# EAGLE design TDA2822M (EAGLE 7.3.0)
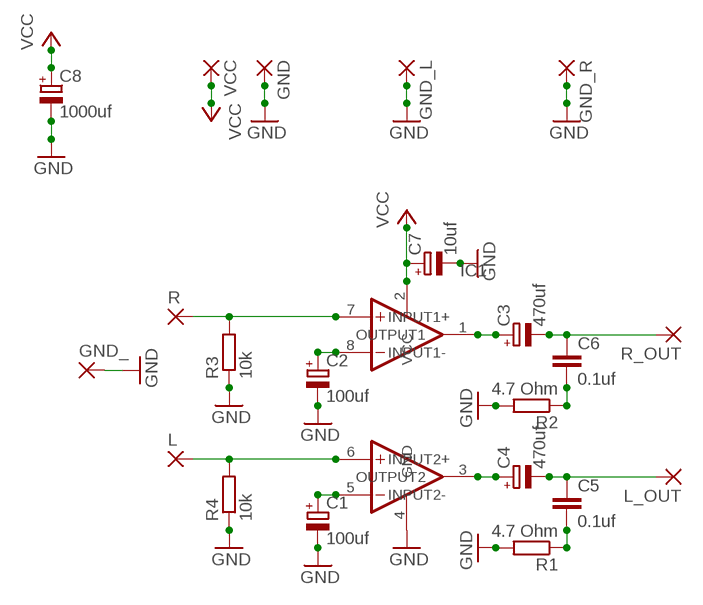
[diagram p0: schematic, sheet 1]

## Parts
C1  100uf  CPOL-EUE2.5-6  [E2,5-6]
C2  100uf  CPOL-EUE2.5-6  [E2,5-6]
C3  470uf  CPOL-EUE2.5-6  [E2,5-6]
C4  470uf  CPOL-EUE2.5-6  [E2,5-6]
C5  0.1uf  C-EU025-030X050  [C025-030X050]
C6  0.1uf  C-EU025-030X050  [C025-030X050]
C7  10uf  CPOL-EUE2.5-6  [E2,5-6]
C8  1000uf  CPOL-EUE5-8.5  [E5-8,5]
GND  2,54/1,1  [2,54/1,1]
GND_  2,54/1,1  [2,54/1,1]
GND_L  2,54/1,1  [2,54/1,1]
GND_R  2,54/1,1  [2,54/1,1]
IC1  TDA2822M  [DIL8]
L  2,54/1,1  [2,54/1,1]
L_OUT  2,54/1,1  [2,54/1,1]
R  2,54/1,1  [2,54/1,1]
R1  4.7 Ohm  R-EU_0204/7  [0204/7]
R2  4.7 Ohm  R-EU_0204/7  [0204/7]
R3  10k  R-EU_0204/7  [0204/7]
R4  10k  R-EU_0204/7  [0204/7]
R_OUT  2,54/1,1  [2,54/1,1]
VCC  2,54/1,1  [2,54/1,1]

## Nets
GND: C1.- C2.- C7.- C8.- GND.1(P) GND_.1(P) GND_L.1(P) GND_R.1(P) IC1.4(GND) R1.2 R2.2 R3.1 R4.1
N$1: C1.+ IC1.5(INPUT2-)
N$2: C2.+ IC1.8(INPUT1-)
N$3: IC1.6(INPUT2+) L.1(P) R4.2
N$4: IC1.7(INPUT1+) R3.2 R.1(P)
N$5: C3.+ IC1.1(OUTPUT1)
N$6: C4.- C5.1 L_OUT.1(P)
N$7: C5.2 R1.1
N$8: C4.+ IC1.3(OUTPUT2)
N$9: C3.- C6.1 R_OUT.1(P)
N$10: C6.2 R2.1
VCC: C7.+ C8.+ IC1.2(VCC) VCC.1(P)

## Library data of the parts
C1-C4 C7 = resistor:CPOL-EU: POLARIZED CAPACITOR, European symbol
C5 C6 = rcl:C-EU: CAPACITOR, European symbol
C8 = rcl:CPOL-EU: POLARIZED CAPACITOR, European symbol
GND GND_ GND_L GND_R L L_OUT R R_OUT VCC = wirepad:2,54/1,1: THROUGH-HOLE PAD
IC1 = TDA2822M:TDA2822M: TDA2822M - DUAL LOW-VOLTAGE POWER AMPLIFIER
R1-R4 = resistor:R-EU_: RESISTOR, European symbol

## Board
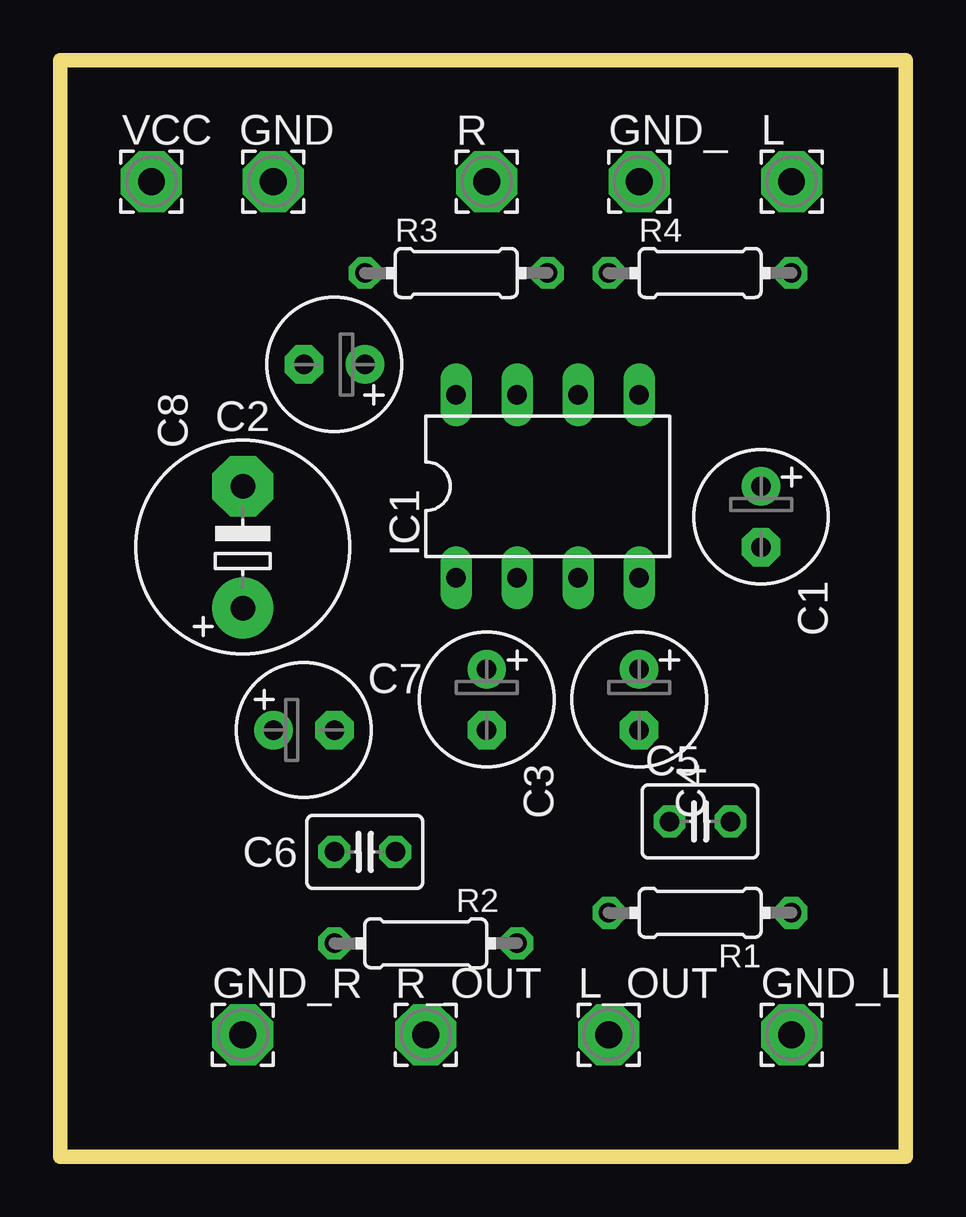
[diagram p1: board, top side]
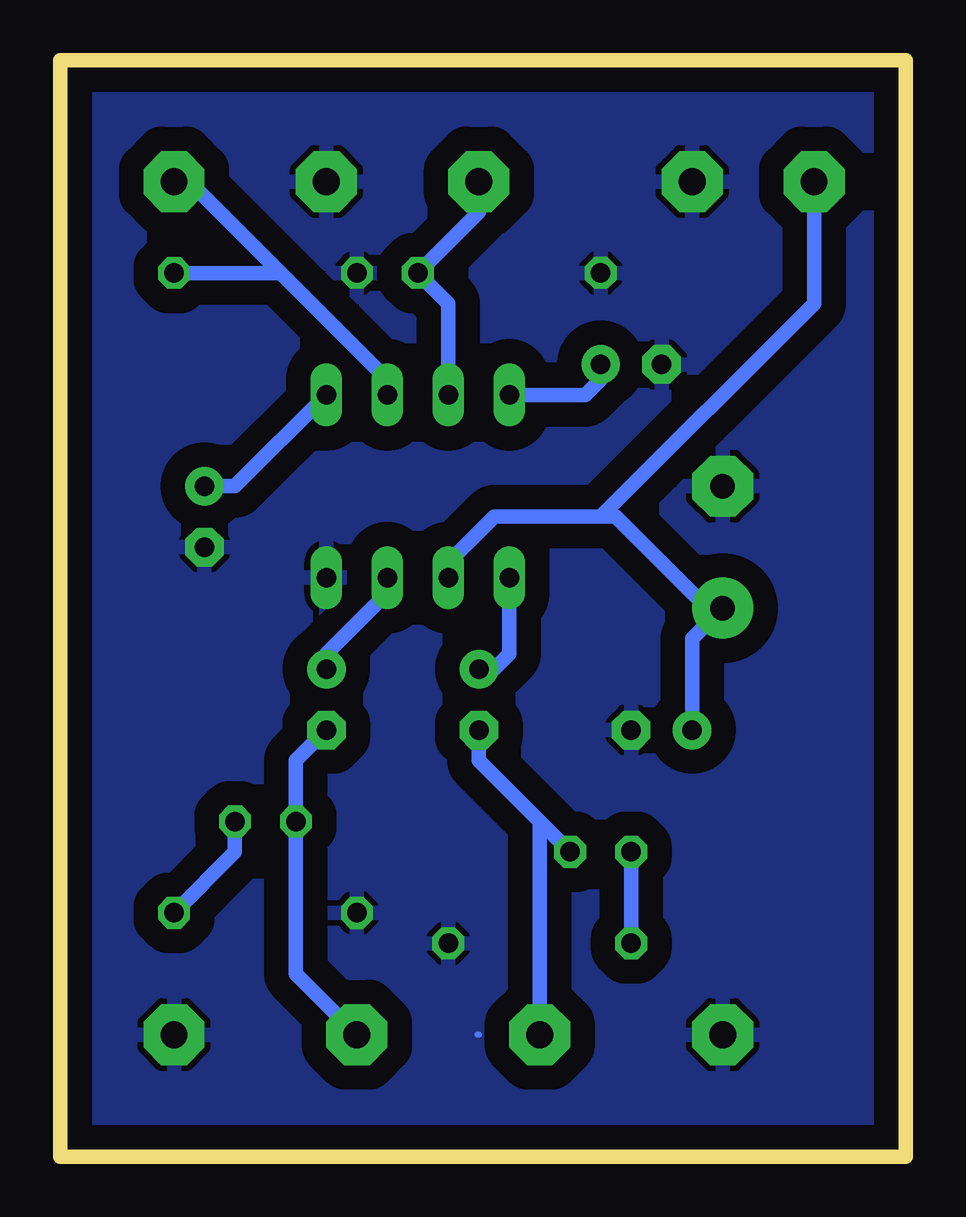
[diagram p2: board, bottom side, seen from below]

Size 35.23 x 45.71 mm. Coordinates in mm from the lower left corner, seen from the top.
Outline: 0,0 35.23,0 35.23,45.71 0,45.71 0,0
Copper layers (1*16): Top 0.035mm / dielectric 1.5mm / Bottom 0.035mm
Design rules "default": minimum track width 10mil, minimum drill 24mil, track to track 8mil, track to pad 8mil, pad to pad 8mil, via to via 8mil, smd to smd 8mil, copper to edge 40mil, drill to drill 8mil, minimum pad ring 10mil, minimum via ring 8mil, stop-mask expansion 4mil, vias tented up to drill 0mil, thermal gap 10mil

### Footprints (pad centres in the part's own frame; a part is rotated, then mirrored left to right if it is on the bottom)
E2,5-6 = drill 0.813 pad 1.6: + -1.27,0 | drill 0.813 pad 1.6 octagon: - 1.27,0
C025-030X050 = drill 0.813 octagon: 1 -1.27,0; 2 1.27,0
E5-8,5 = drill 1.016 pad 2.54: + -2.54,0 | drill 1.016 pad 2.54 octagon: - 2.54,0
2,54/1,1 = drill 1.118 pad 2.54 octagon: 1 0,0
DIL8 = drill 0.813 long: 1 -3.81,-3.81; 2 -1.27,-3.81; 3 1.27,-3.81; 4 3.81,-3.81; 5 3.81,3.81; 6 1.27,3.81; 7 -1.27,3.81; 8 -3.81,3.81
0204/7 = drill 0.813 octagon: 1 -3.81,0; 2 3.81,0

### Placement (x,y rotation side)
C1  29.21,26.67 270 top
C2  11.43,33.02 180 top
C3  17.78,19.05 270 top
C4  24.13,19.05 270 top
C5  26.67,13.97 0 top
C6  12.7,12.7 180 top
C7  10.16,17.78 0 top
C8  7.62,25.4 90 top
GND  8.89,40.64 0 top
GND_  24.13,40.64 0 top
GND_L  30.48,5.08 0 top
GND_R  7.62,5.08 0 top
IC1  20.32,27.94 0 top
L  30.48,40.64 0 top
L_OUT  22.86,5.08 0 top
R  17.78,40.64 0 top
R1  26.67,10.16 180 top
R2  15.24,8.89 0 top
R3  16.51,36.83 0 top
R4  26.67,36.83 0 top
R_OUT  15.24,5.08 0 top
VCC  3.81,40.64 0 top

### Tracks (layer width: path | path; a pad name or v marks a point on that pad's centre or on a via)
GND
  Bottom 0.254: 17.78,5.08 17.83,5.08
  pour Bottom (isolate 1.016): 0,45.72 0,0 35.56,0 35.56,45.72
N$1
  Bottom 0.61: IC1.5 27.94,27.94 C1.+
N$2
  Bottom 0.61: IC1.8 13.33,31.75 12.7,32.38 C2.+
N$3
  Bottom 0.61: IC1.6 21.59,32.38 26.04,36.83 | 26.04,36.83 29.84,40.64 L.1 | 26.04,36.83 R4.2
N$4
  Bottom 0.61: IC1.7 19.05,35.56 R3.2 17.78,39.37 R.1
N$5
  Bottom 0.61: IC1.1 16.51,20.95 17.14,20.32 C3.+
N$6
  Bottom 0.61: C4.- 25.4,16.51 C5.1 25.4,7.62 L_OUT.1
N$7
  Bottom 0.61: R1.1 27.94,12.7 C5.2
N$8
  Bottom 0.61: IC1.3 21.59,23.49 24.13,20.95 C4.+
N$9
  Bottom 0.61: 15.24,13.97 17.78,16.51 C3.- | 15.24,13.97 C6.1 | 15.24,13.97 R_OUT.1
N$10
  Bottom 0.61: C6.2 R2.1
VCC
  Bottom 0.61: IC1.2 19.05,24.77 17.14,26.67 12.7,26.67 | 12.7,26.67 12.06,26.67 8.26,22.86 C8.+ 8.89,21.59 C7.+ | VCC.1 3.81,35.56 12.7,26.67